# EAGLE design HP4-1 (EAGLE 8.6.3)
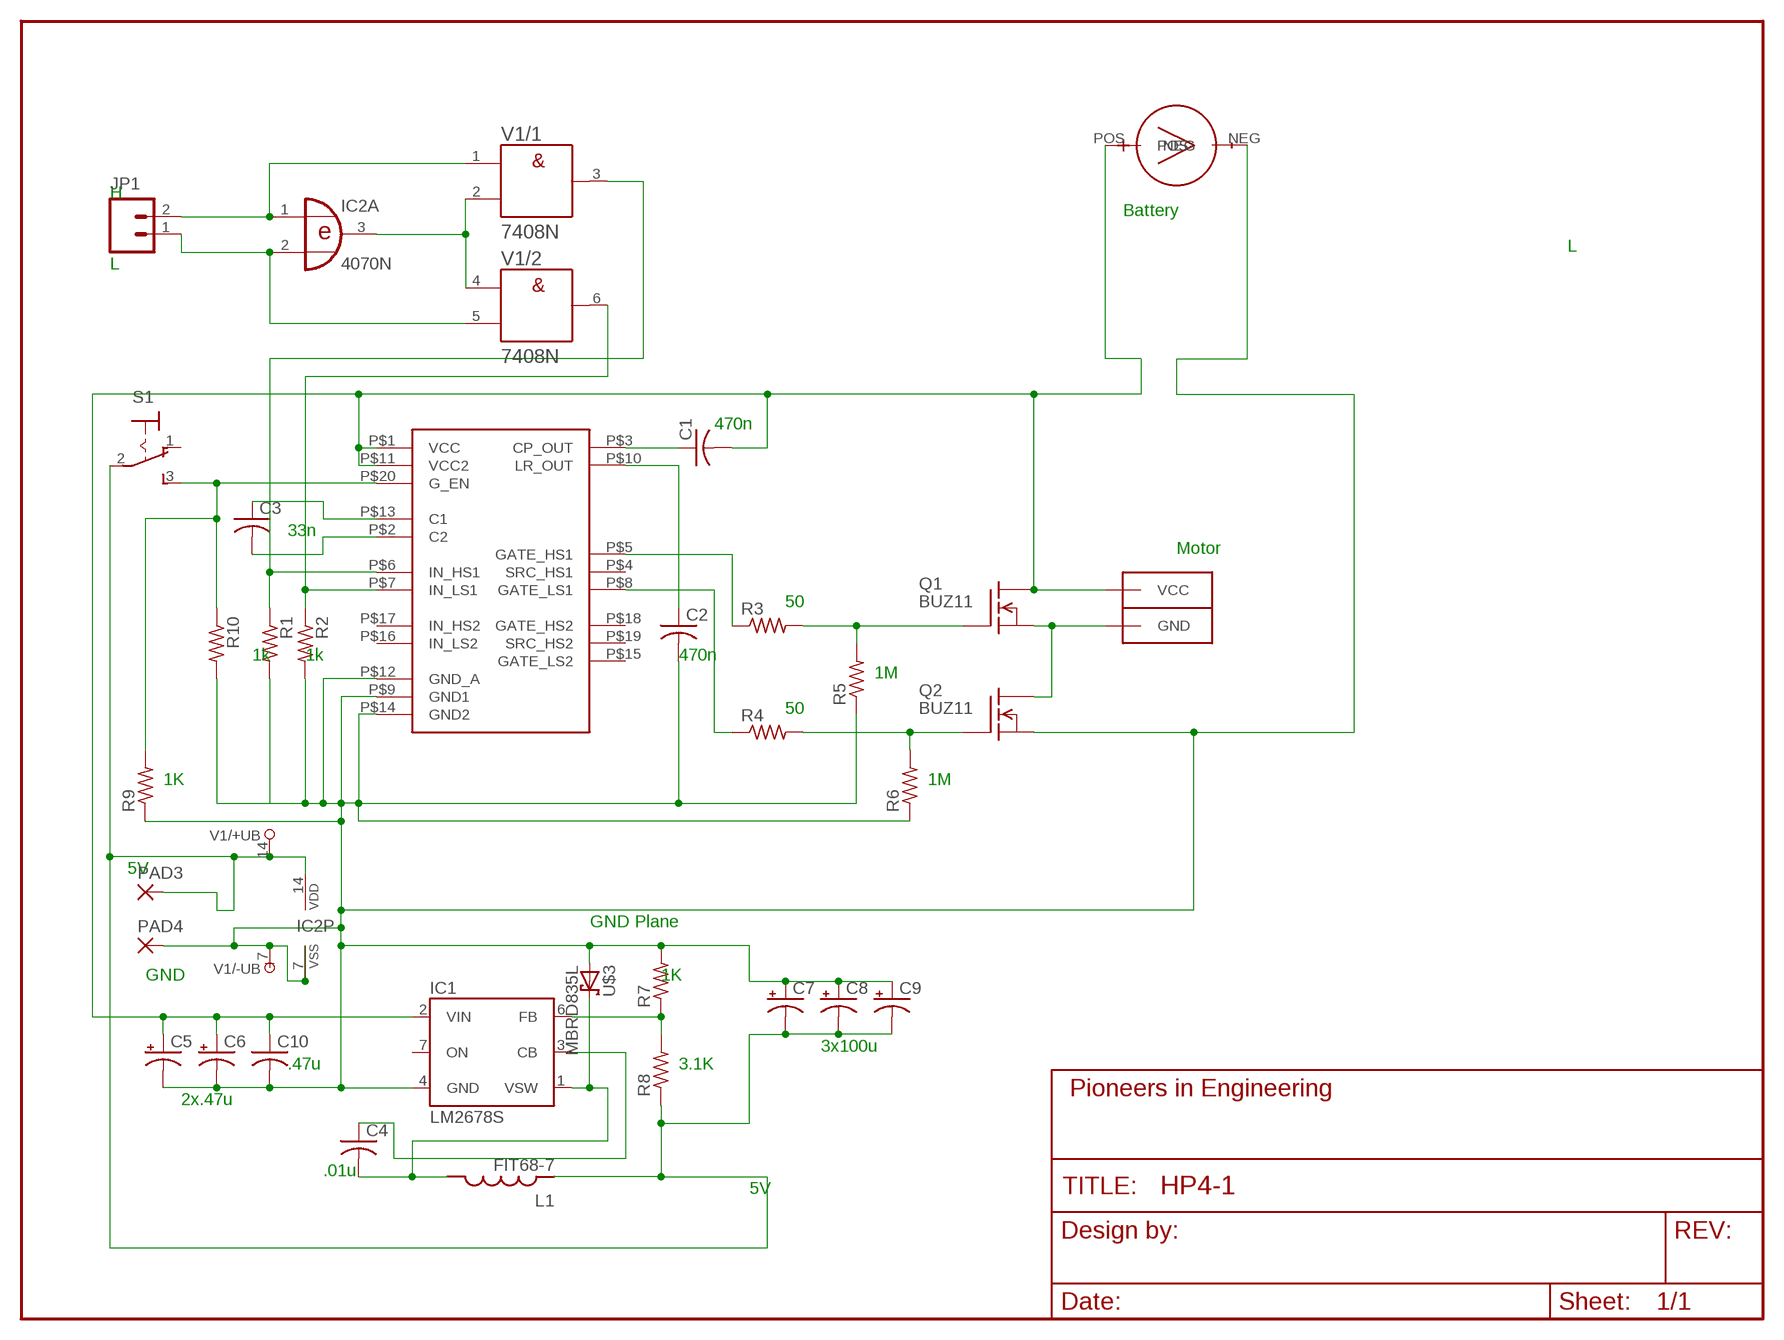
[diagram p0: schematic, sheet 1]

## Parts
C1  C-USC1206  [C1206]
C2  C-USC1206  [C1206]
C3  C-USC1206  [C1206]
C4  C-US025-024X044  [C025-024X044]
C5  CPOL-USCT6032  [CT6032]
C6  CPOL-USCT6032  [CT6032]
C7  CPOL-USCT6032  [CT6032]
C8  CPOL-USCT6032  [CT6032]
C9  CPOL-USCT6032  [CT6032]
C10  C-USC1206  [C1206]
IC1  LM2678S  [TO263-7]
IC2  4070N  [DIL14]
JP1  M02PTH  [1X02]
L1  FIT68-7  [FIT68-7]
MOTOR  ANDERSON_PP_DOUBLEHORIZONTAL  [ANDERSON_PP_DOUB_HORZ]
PAD3  3,17/1,3  [3,17/1,3]
PAD4  3,17/1,3  [3,17/1,3]
Q1  BUZ11  [TO220]
Q2  BUZ11  [TO220]
R1  R-US_M1206  [M1206]
R2  R-US_M1206  [M1206]
R3  R-US_M1206  [M1206]
R4  R-US_M1206  [M1206]
R5  R-US_M1206  [M1206]
R6  R-US_M1206  [M1206]
R7  R-US_R1206  [R1206]
R8  R-US_R1206  [R1206]
R9  R-US_R1206  [R1206]
R10  R-US_M1206  [M1206]
S1  320-916  [320-916]
U$1  MC33883DIL20_600MIL_CARRIER  [DIL20_600MIL]
U$3  MBRD835L  [DPAK]
U$4  BATT  [BATT]
V1  7408N  [DIL14]

## Nets
GND: C2.2 C5.- C6.- C7.+ C8.+ C9.+ C10.2 IC1.4(GND) IC2.7(P:VSS) PAD4.1(P) Q2.3(S) R1.2 R2.2 R5.1 R6.1 R7.2 R9.1 R10.2 U$1.P$9(GND1) U$1.P$12(GND_A) U$1.P$14(GND2) U$3.P$1(A) U$3.P$2(A) U$4.NEG V1.7(/-UB:-UB)
N$1: R1.1 U$1.P$6(IN_HS1) V1.3(/1:Y)
N$2: R2.1 U$1.P$7(IN_LS1) V1.6(/2:Y)
N$4: Q1.1(G) R3.2 R5.2
N$5: C1.1 U$1.P$3(CP_OUT)
N$6: Q2.1(G) R4.2 R6.2
N$7: C1.2 C5.+ C6.+ C10.1 IC1.2(VIN) MOTOR.PIN2(VCC) MOTOR.PIN2-LEAD(VCC) Q1.2(D) U$1.P$1(VCC) U$1.P$11(VCC2) U$4.POS
N$8: MOTOR.PIN1(GND) MOTOR.PIN1-LEAD(GND) Q1.3(S) Q2.2(D)
N$9: IC1.6(FB) R7.1 R8.2
N$10: R3.1 U$1.P$5(GATE_HS1)
N$11: R4.1 U$1.P$8(GATE_LS1)
N$12: C2.1 U$1.P$10(LR_OUT)
N$13: C7.- C8.- C9.- IC2.14(P:VDD) L1.P$1 PAD3.1(P) R8.1 S1.2(P) V1.14(/+UB:+UB)
N$14: C3.1 U$1.P$13(C1)
N$15: C3.2 U$1.P$2(C2)
N$16: IC2.1(A:I0) JP1.2 V1.1(/1:A)
N$17: C4.1 IC1.3(CB)
N$18: C4.2 IC1.1(VSW) L1.P$2 U$3.P$3(C)
N$19: R9.2 R10.1 S1.3(S) U$1.P$20(G_EN)
N$20: IC2.2(A:I1) JP1.1 V1.5(/2:B)
N$21: IC2.3(A:O) V1.2(/1:B) V1.4(/2:A)
Unconnected: IC1.7(ON) IC2.4(B:O) IC2.5(B:I0) IC2.6(B:I1) IC2.8(C:I0) IC2.9(C:I1) IC2.10(C:O) IC2.11(D:O) IC2.12(D:I0) IC2.13(D:I1) S1.1(O) U$1.P$4(SRC_HS1) U$1.P$15(GATE_LS2) U$1.P$16(IN_LS2) U$1.P$17(IN_HS2) U$1.P$18(GATE_HS2) U$1.P$19(SRC_HS2) V1.8(/3:Y) V1.9(/3:A) V1.10(/3:B) V1.11(/4:Y) V1.12(/4:A) V1.13(/4:B)

## Notes on the sheet
- H
- Battery
- L
- L
- 470n
- 33n
- Motor
- 50
- 1k | 1k | 470n
- 1M
- 50
- 1K | 1M
- 5V
- GND Plane
- GND | 1K
- 3x100u
- .47u | 3.1K
- 2x.47u
- .01u
- 5V

## Library data of the parts
C1-C4 C10 = rcl:C-US: CAPACITOR, American symbol
C5-C9 = rcl:CPOL-US: POLARIZED CAPACITOR, American symbol
IC1 = v-reg-3:LM2678: National Semiconductor <http://www.national.com> 5.0A "Simple Switcher"(c) 260kHz, Vout 1.2-37V, Vin 40V, 120mOhm DMOS switch, 50µA standby current
IC2 = 40xx:4070: Quad 2-input XOR
JP1 = ee192_1:M02: 2-pin 0.1-inch header and MTA connector Courtsey of Pioneers in Engineering; PIE-INT-REF-NUM: BULK-STOCK
L1 = ee192_1:FIT68-7: FIT68-7 Switchmode/High Frequency Toroidal Inductor
MOTOR = ee192_1:ANDERSON_PP_DOUBLE: 2-pin 25A Anderson Connector http://www.alliedelec.com/images/products/datasheets/bm/ANDERSON_POWER_PRODUCTS/70162018.pdf; PIE-INT-REF-NUM: Anderson
PAD3 PAD4 = wirepad:3,17/1,3: THROUGH-HOLE PAD
Q1 Q2 = transistor-fet:BUZ11: N-Channel Enhancement MOSFET 50V; 30A; 0,040Ohm
R1-R10 = resistor:R-US_: RESISTOR, American symbol
S1 = switch:320-916: TOGGLE SWITCH distributor RS Components
U$1 = ee192_1:MC33883
U$3 = natcar:MBRD835L
U$4 = natcar:BATT
V1 = 74ttl-din:74*08: Quad 2-input AND gate

## Board
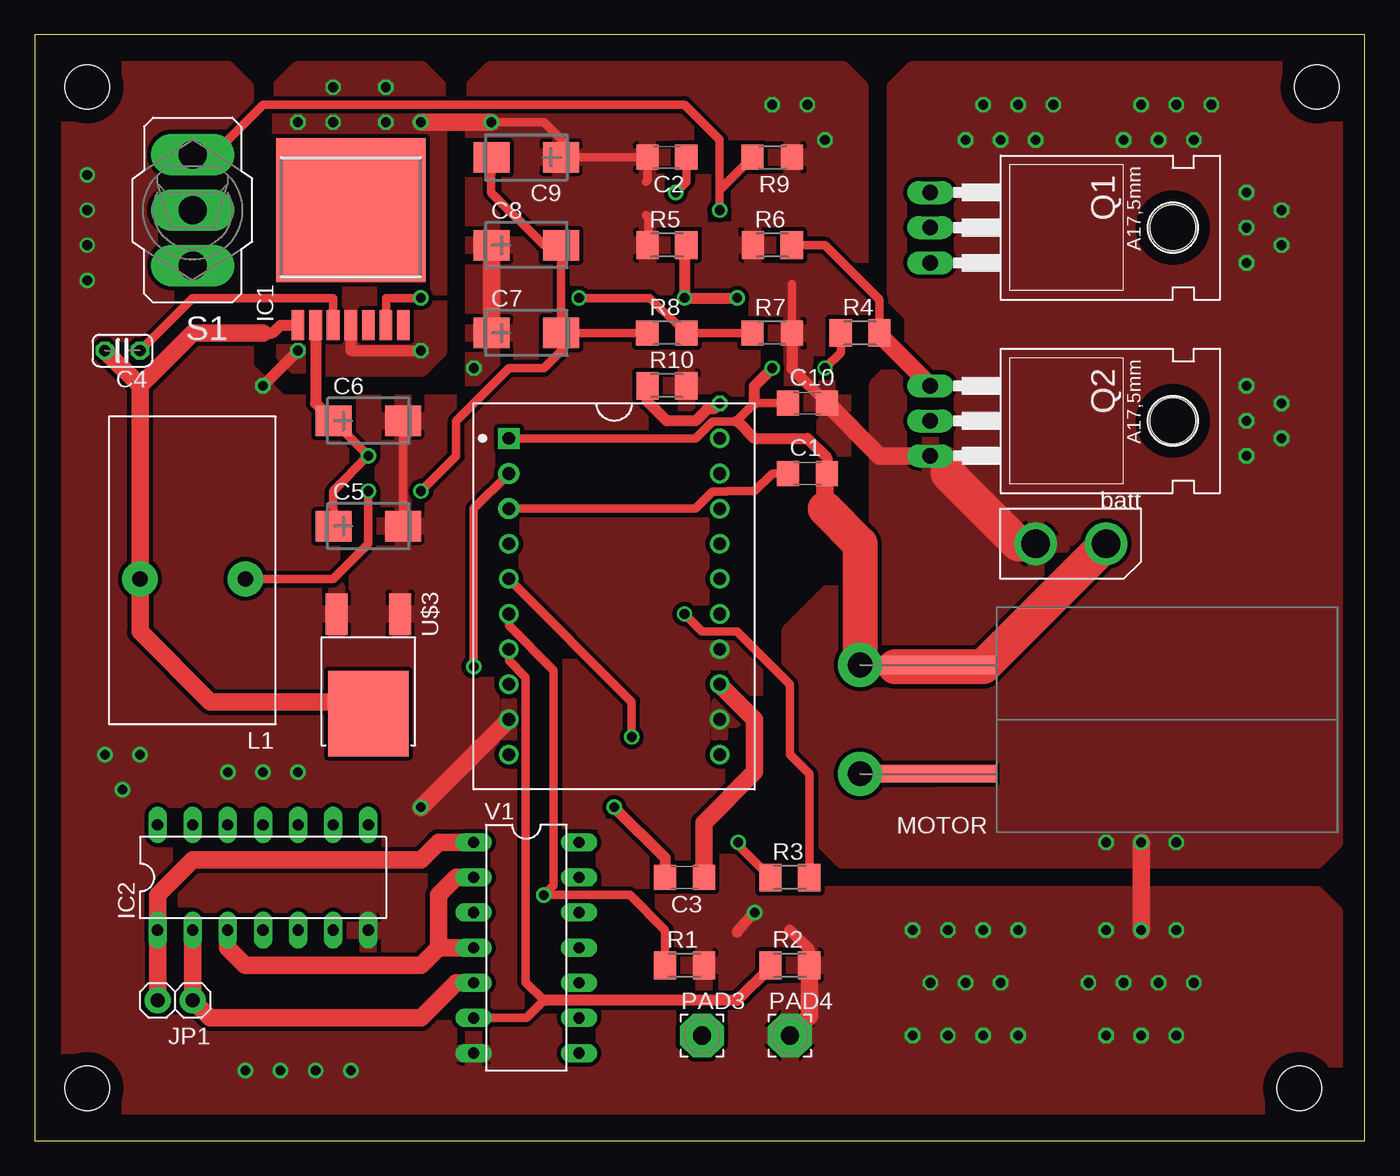
[diagram p1: board, top side]
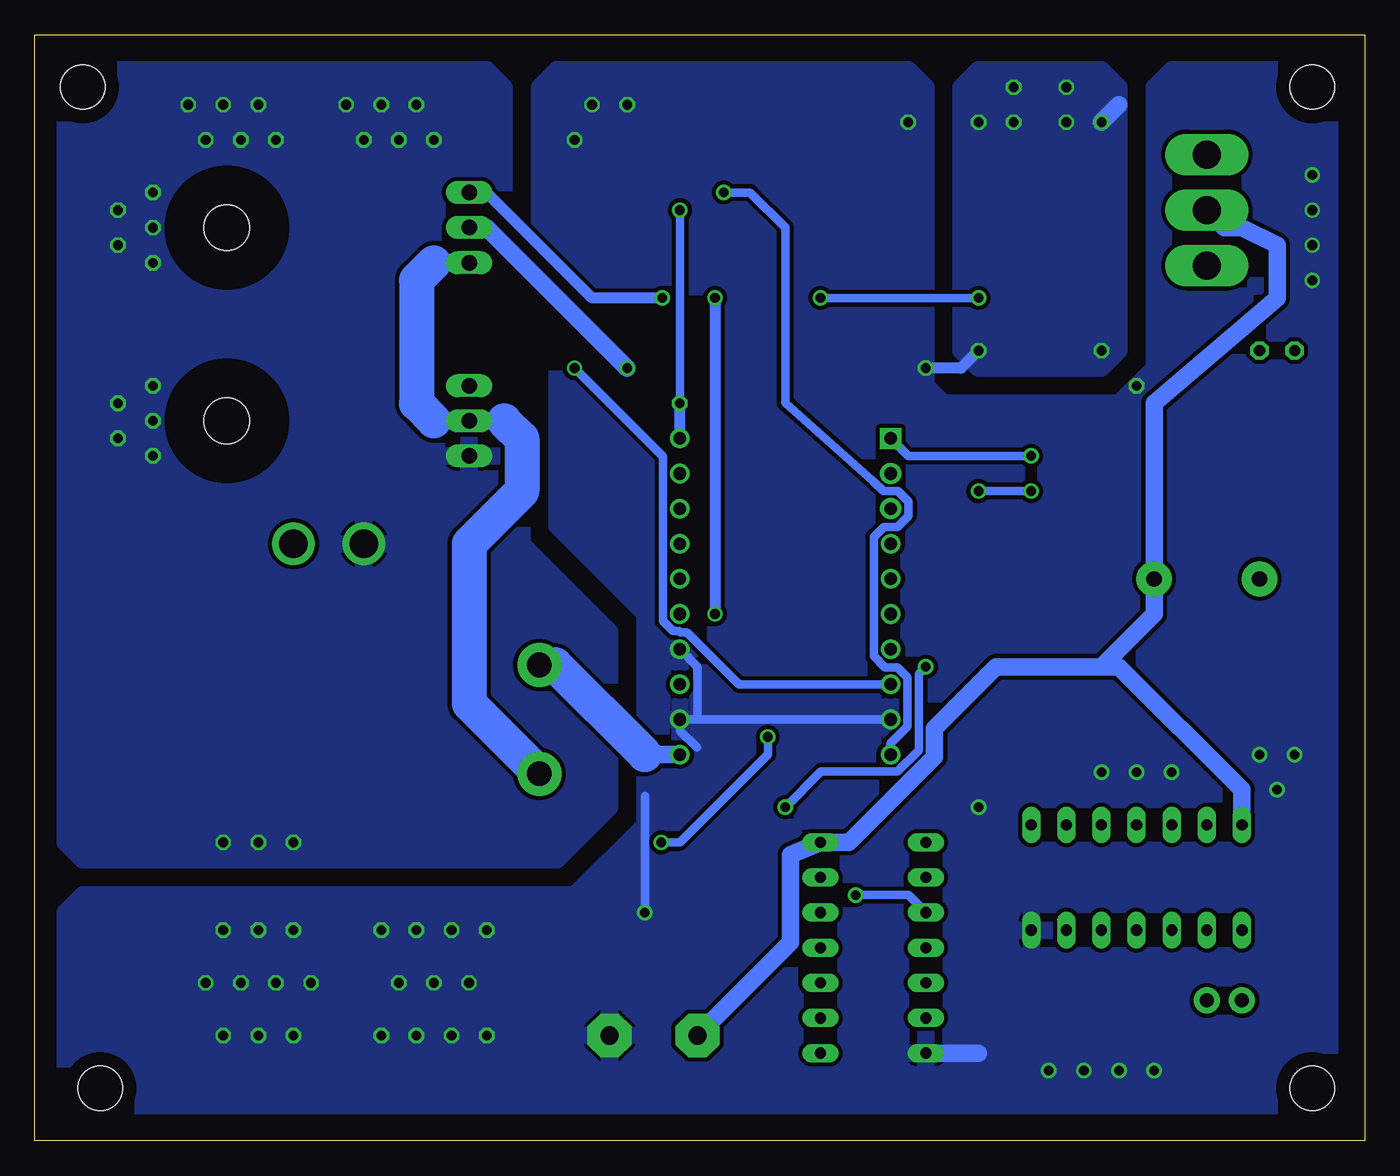
[diagram p2: board, bottom side, seen from below]

Size 96.19 x 80 mm. Coordinates in mm from the lower left corner, seen from the top.
Outline: 0,0 96.19,0 96.19,80 0,80 0,0
Copper layers (1*16): Top 0.035mm / dielectric 1.5mm / Bottom 0.035mm
Design rules "default": minimum track width 10mil, minimum drill 24mil, track to track 8mil, track to pad 8mil, pad to pad 8mil, via to via 8mil, smd to smd 8mil, copper to edge 40mil, drill to drill 8mil, minimum pad ring 10mil, minimum via ring 8mil, stop-mask expansion 4mil, vias tented up to drill 0mil, thermal gap 10mil
Holes 3.2 mm at 3.81,76.2 3.81,3.81 91.44,3.81 92.71,76.2

### Footprints (pad centres in the part's own frame; a part is rotated, then mirrored left to right if it is on the bottom)
C1206 = smd 1.6 x 1.8: 1 -1.4,0; 2 1.4,0
C025-024X044 = drill 0.813 octagon: 1 -1.27,0; 2 1.27,0
CT6032 = smd 2.6 x 2.2: + -2.5,0; - 2.5,0
TO263-7 = smd 0.91 x 2.16: 1 -3.81,-5.78; 2 -2.54,-5.78; 3 -1.27,-5.78; 4 0,-5.78; 5 1.27,-5.78; 6 2.54,-5.78; 7 3.81,-5.78 | smd 10.8 x 10.41: 8 0,2.54
DIL14 = drill 0.813 long: 1 -7.62,-3.81; 2 -5.08,-3.81; 3 -2.54,-3.81; 4 0,-3.81; 5 2.54,-3.81; 6 5.08,-3.81; 7 7.62,-3.81; 8 7.62,3.81; 9 5.08,3.81; 10 2.54,3.81; 11 0,3.81; 12 -2.54,3.81; 13 -5.08,3.81; 14 -7.62,3.81
1X02 = drill 1.016 pad 1.88: 1 -1.27,0; 2 1.27,0
FIT68-7 = drill 1.1 pad 2.54: P$1 -3.81,0; P$2 3.81,0
ANDERSON_PP_DOUB_HORZ = drill 1.778 pad 3.175: PIN1 0,3.937; PIN2 0,-3.937 | smd 8.89 x 1.27: PIN1-LEAD -5.334,3.937; PIN2-LEAD -5.334,-3.937
3,17/1,3 = drill 1.321 pad 3.175 octagon: 1 0,0
TO220 = drill 1.118 long: 1 -2.54,-6.35; 2 0,-6.35; 3 2.54,-6.35 | hole 3.302: 0,11.176
M1206 = smd 1.6 x 2: 1 -1.4,0; 2 1.4,0
R1206 = smd 1.6 x 1.803: 1 -1.422,0; 2 1.422,0
320-916 = drill 2.007 long: 1 0,4.013; 2 0,0; 3 0,-4.013
DIL20_600MIL = drill 0.914 pad 1.524 square: P$1 -11.43,-7.62 | drill 0.914 pad 1.524: P$2 -8.89,-7.62; P$3 -6.35,-7.62 | drill 0.914: P$4 -3.81,-7.62; P$5 -1.27,-7.62; P$6 1.27,-7.62; P$7 3.81,-7.62; P$8 6.35,-7.62; P$9 8.89,-7.62; P$10 11.43,-7.62; P$11 11.43,7.62; P$12 8.89,7.62; P$13 6.35,7.62; P$14 3.81,7.62; P$15 1.27,7.62; P$16 -1.27,7.62; P$17 -3.81,7.62; P$18 -6.35,7.62; P$19 -8.89,7.62; P$20 -11.43,7.62
DPAK = smd 1.6 x 3: P$1 -2.3,0; P$2 2.3,0 | smd 5.8 x 6.2: P$3 0,7.2
BATT = drill 2.052: NEG -2.54,0; POS -7.62,0

### Placement (x,y rotation side)
C1  55.88,48.26 0 top
C2  45.72,71.12 180 top
C3  46.99,19.05 180 top
C4  6.35,57.15 180 top
C5  24.13,44.45 0 top
C6  24.13,52.07 0 top
C7  35.56,58.42 0 top
C8  35.56,64.77 0 top
C9  35.56,71.12 180 top
C10  55.88,53.34 0 top
IC1  22.86,64.77 0 top
IC2  16.51,19.05 0 top
JP1  10.16,10.16 180 top
L1  11.43,40.64 180 top
MOTOR  59.69,30.48 180 top
PAD3  48.26,7.62 0 top
PAD4  54.61,7.62 0 top
Q1  71.12,66.04 270 top
Q2  71.12,52.07 270 top
R1  46.99,12.7 0 top
R2  54.61,12.7 0 top
R3  54.61,19.05 0 top
R4  59.69,58.42 0 top
R5  45.72,64.77 0 top
R6  53.34,64.77 0 top
R7  53.34,58.42 0 top
R8  45.72,58.42 0 top
R9  53.34,71.12 180 top
R10  45.72,54.61 0 top
S1  11.43,67.31 180 top
U$1  41.91,39.37 270 top
U$3  24.13,38.1 180 top
U$4  69.85,43.18 180 top
V1  35.56,13.97 270 top

### Tracks (layer width: path | path; a pad name or v marks a point on that pad's centre or on a via)
GND  (via drill 0.7)
  Top 0.254: 26.54,44.37 C5.- | 26.54,38.2 U$3.P$1 26.31,38.2 | 21.97,38.2 U$3.P$2 | 26.54,52.15 C6.- 26.77,52.15 | 32.94,58.32 C7.+ | 38.1,71.12 C9.+ 37.97,71.12 | 44.37,64.95 R5.1 44.14,64.72 | 44.37,71.12 C2.2 | 33.17,64.72 C8.+
  Top 0.61: U$1.P$9 34.05,30.48 | 54.76,61.95 R7.2 | R5.1 44.6,64.77 | 31.75,73.66 v33.02,73.66 36.83,73.66 38.1,72.39 38.1,71.12 | C9.+ 44.37,71.12 | C2.2 44.32,69.47 44.2,69.35 | 44.2,66.94 44.37,66.77 44.37,64.95 | C5.- C6.-
  Top 0.813: v52.07,16.51 50.8,15.11 50.93,15.24 | R2.2 56.01,13.84 54.61,15.24 | 26.54,52.2 26.54,52.15 | R7.2 54.76,55.86 C10.2 | v19.05,57.15 v16.51,54.61 | IC1.4 22.86,57.15 v27.94,57.15
  Top 1.27: v27.94,24.13 U$1.P$9 | PAD4.1 56.01,9.02 R2.2 | 66.04,48.26 Q2.3 61.09,49.53 C10.2 | C8.+ C7.+ | v80.01,21.59 v80.01,15.24 | v27.94,73.66 v33.02,73.66
  Top 2.54: 66.04,48.26 71.12,43.18 U$4.NEG
  Bottom 0.61: U$1.P$9 48.26,30.48 | 48.26,30.48 U$1.P$12 49.53,29.66 48.31,28.45 | U$1.P$14 48.26,34.29 48.26,30.48 | v52.07,16.51 52.07,24.95
  Bottom 0.813: v27.94,57.15 29.21,55.88 v31.75,55.88
  Bottom 1.27: 27.94,6.35 V1.7 | v19.05,73.66 17.78,74.93
  other vias: 78.74,11.43 81.28,11.43 76.2,11.43 77.47,15.24 82.55,15.24 83.82,11.43 77.47,7.62 80.01,7.62 82.55,7.62 71.12,7.62 68.58,7.62 66.04,7.62 63.5,7.62 64.77,11.43 67.31,11.43 69.85,11.43 71.12,15.24 68.58,15.24 66.04,15.24 63.5,15.24 15.24,5.08 17.78,5.08 20.32,5.08 22.86,5.08 6.35,25.4 5.08,27.94 7.62,27.94 13.97,26.67 16.51,26.67 19.05,26.67 3.81,62.23 3.81,64.77 3.81,67.31 3.81,69.85 53.34,74.93 55.88,74.93 57.15,72.39 67.31,72.39 68.58,74.93 69.85,72.39 71.12,74.93 73.66,74.93 72.39,72.39 80.01,74.93 78.74,72.39 81.28,72.39 82.55,74.93 85.09,74.93 83.82,72.39 87.63,68.58 87.63,66.04 87.63,63.5 90.17,64.77 90.17,67.31 87.63,54.61 87.63,52.07 87.63,49.53 90.17,50.8 90.17,53.34 77.47,21.59 82.55,21.59 21.59,73.66 25.4,73.66 25.4,76.2 21.59,76.2
  pour Bottom (isolate 0.305): 2.54,76.2 3.81,77.47 13.97,77.47 15.24,76.2 15.24,55.88 17.78,53.34 30.48,53.34 31.75,54.61 31.75,76.2 33.02,77.47 58.42,77.47 59.69,76.2 59.69,60.96 60.96,59.69 58.42,55.88 58.42,44.45 52.07,38.1 52.07,22.86 57.15,17.78 92.71,17.78 93.98,16.51 93.98,3.81 92.71,2.54 3.81,2.54 2.54,3.81
  pour Top (isolate 0.305): 2.54,76.2 3.81,77.47 13.97,77.47 15.24,76.2 15.24,55.88 17.78,53.34 30.48,53.34 31.75,54.61 31.75,76.2 33.02,77.47 58.42,77.47 59.69,76.2 59.69,60.96 60.96,59.69 58.42,55.88 58.42,44.45 52.07,38.1 52.07,22.86 57.15,17.78 92.71,17.78 93.98,16.51 93.98,3.81 92.71,2.54 3.81,2.54 2.54,3.81
  pour Top (isolate 0.305): 17.78,76.2 17.78,57.15 19.05,55.88 27.94,55.88 29.21,57.15 29.21,76.2 27.94,77.47 19.05,77.47
  pour Bottom (isolate 0.305): 93.98,76.2 92.71,77.47 63.5,77.47 62.23,76.2 62.23,60.96 63.5,59.69 63.5,57.15 60.96,54.61 60.96,43.18 54.61,36.83 54.61,24.13 58.42,20.32 92.71,20.32 93.98,21.59
  pour Top (isolate 0.305): 58.42,20.32 92.71,20.32 93.98,21.59 93.98,76.2 92.71,77.47 63.5,77.47 62.23,76.2 62.23,60.96 63.5,59.69 63.5,57.15 60.96,54.61 60.96,43.18 54.61,36.83 54.61,24.13
  pour Bottom (isolate 0.305): 19.05,77.47 17.78,76.2 17.78,57.15 19.05,55.88 27.94,55.88 29.21,57.15 29.21,76.2 27.94,77.47
N$1  (via drill 0.7)
  Top 0.61: U$1.P$6 34.29,37.28 37.54,34.03 37.54,18.49 v36.83,17.78 43.05,17.78 45.59,15.24 R1.1
  Bottom 0.61: v36.83,17.78 33.02,17.78 V1.3
N$2
  Top 0.61: V1.6 35.56,8.89 36.83,10.16 35.51,11.48 35.51,33.52 34.29,34.74 U$1.P$7
  Top 0.813: R2.1 53.21,12.57 50.8,10.16 36.83,10.16
N$4  (via drill 0.7)
  Top 0.61: v46.99,38.1 48.26,36.83 50.8,36.83 54.61,33.02 54.61,27.94 56.01,26.54 R3.2
  Top 0.813: R5.2 46.99,64.64 v46.99,60.96 v50.8,60.96
  Bottom 0.813: v46.99,60.96 v46.99,38.1 | v50.8,60.96 55.88,60.96 63.5,68.58 Q1.1
N$5
  Top 0.61: U$1.P$3 47.81,45.72 49.02,46.94 50.03,46.94 50.09,46.99 52.07,46.99 53.34,48.26 C1.1
N$6
  Top 0.61: R4.2 61.09,60.83 57.15,64.77 R6.2
  Top 1.27: R4.2 61.09,58.29 Q2.1
N$7  (via drill 0.7)
  Top 0.254: 21.51,52.15 C6.+ 21.51,51.92 | 21.51,44.37 C5.+
  Top 0.61: C6.+ 24.13,49.57 | 24.13,49.57 v24.13,49.53 | U$1.P$1 47.81,50.8 49.02,52.02 50.72,52.02 52.04,53.34 C10.1 | C5.+ 21.59,46.99 24.13,49.57
  Top 0.813: IC1.2 20.32,53.34 21.59,52.07 C6.+ | 52.04,53.34 52.04,54.58 v53.34,55.88 | 50.72,52.02 50.85,52.02 52.07,50.8 55.88,50.8 57.28,49.4 C1.2
  Top 1.27: C1.2 57.15,48.13 57.15,45.72 | 62.23,34.29 59.82,34.29 MOTOR.PIN2 MOTOR.PIN2-LEAD
  Top 2.54: 57.15,45.72 59.69,43.18 MOTOR.PIN2 | U$4.POS 68.58,34.29 62.23,34.29
  Bottom 0.61: v24.13,49.53 33.02,49.53 U$1.P$1
  Bottom 1.27: v53.34,55.88 63.5,66.04 Q1.2 | U$1.P$11 52.07,27.94
  Bottom 2.54: 52.07,27.94 58.55,34.42 MOTOR.PIN2
N$8
  Top 1.27: MOTOR.PIN1 MOTOR.PIN1-LEAD
  Bottom 1.27: Q1.3 67.31,63.5 | 67.31,52.07 Q2.2 62.23,52.07
  Bottom 2.54: 67.31,63.5 68.58,62.23 68.58,53.34 67.31,52.07 | 62.23,52.07 60.96,50.8 60.96,46.99 64.77,43.18 64.77,31.62 MOTOR.PIN1
N$9  (via drill 0.7)
  Top 0.254: 47.12,58.55 R8.2
  Top 0.61: R7.1 R8.2 44.45,60.96 v39.37,60.96 | v27.94,60.96 25.4,60.96 IC1.6
  Bottom 0.61: v39.37,60.96 v27.94,60.96
N$10  (via drill 0.7)
  Top 0.61: R3.1 50.67,21.59 v50.88,21.59 | v43.18,29.21 43.18,31.75 U$1.P$5
  Bottom 0.61: v50.88,21.59 49.53,21.59 43.18,27.94 v43.18,29.21
N$11  (via drill 0.7)
  Top 0.61: R4.1 58.29,57.02 v57.15,55.88
  Bottom 0.61: v57.15,55.88 54.61,53.34 50.75,49.48 50.75,37.59 50.03,36.88 49.58,36.88 49.48,36.78 49.02,36.78 45.27,33.02 U$1.P$8
N$12  (via drill 0.7)
  Top 0.61: 46.99,70.99 C2.1 47.12,69.35 v46.35,68.58
  Bottom 0.61: U$1.P$10 34.29,28.76 33.07,29.97 33.07,33.52 33.79,34.24 34.69,34.24 35.51,35.05 35.51,43.69 34.8,44.4 33.81,44.4 33.02,45.19 33.02,46.25 33.76,46.99 34.82,46.99 35.56,47.73 41.91,53.34 41.91,66.04 44.45,68.58 v46.35,68.58
N$13  (via drill 0.7, 0.7 pad 0.61)
  Top 0.254: 32.94,71.12 C9.- | 44.14,58.55 R8.1 | 38.2,58.55 C7.-
  Top 0.61: C7.- R8.1 | C7.- C8.- 36.83,64.77 33.02,68.58 C9.- | L1.P$1 21.59,40.64 24.13,43.18 v24.13,46.99 | v27.94,46.99 30.48,49.53 30.48,52.07 34.29,55.88 36.83,55.88 38.1,57.15 C7.-
  Bottom 0.61: v24.13,46.99 v27.94,46.99
  Bottom 1.27: 19.05,34.29 15.24,38.1 L1.P$1 15.24,53.34 6.35,60.96 6.35,64.77 8.89,66.04 10.16,66.04 S1.2 | 19.05,34.29 26.67,34.29 31.11,29.84 31.11,27.77 37.3,21.59 V1.14 41.53,20.7 41.53,14.35 PAD3.1 | IC2.14 8.89,25.4 17.78,34.29 19.05,34.29
N$14
  Top 1.27: U$1.P$13 52.07,30.48 52.07,26.67 48.39,22.99 C3.1
N$15  (via drill 0.7)
  Top 0.61: U$1.P$2 31.75,45.72 v31.75,34.29
  Top 0.813: v41.91,24.13 45.59,20.45 C3.2
  Bottom 0.61: v31.75,34.29 32.26,33.78 32.26,28.25 33.79,26.72 39.32,26.72 v41.91,24.13
N$16
  Top 0.254: 8.94,15.34 IC2.1
  Top 1.27: JP1.2 IC2.1 8.89,17.78 11.43,20.32 27.94,20.32 29.21,21.59 V1.1
N$17
  Top 0.61: C4.1 11.43,60.96 21.59,60.96 IC1.3
N$18
  Top 0.254: 24.03,31.11 U$3.P$3 | 7.8,40.49 L1.P$2
  Top 0.813: 16.51,58.42 17.21,58.42 17.78,58.99 IC1.1
  Top 1.27: U$3.P$3 22.86,31.75 12.7,31.75 7.62,36.83 L1.P$2 7.62,54.61 | 7.62,54.61 11.43,58.42 16.51,58.42 | 7.62,54.61 C4.2
N$19  (via drill 0.7)
  Top 0.61: 49.53,68.73 R9.2 | 49.53,68.73 v49.53,67.31 | 49.53,68.73 49.53,72.39 46.99,74.93 16.51,74.93 12.9,71.32 S1.3
  Top 0.813: v49.53,53.34 49.12,52.93 48.65,52.93 47.78,52.07 45.72,52.07 44.32,53.47 R10.1
  Bottom 0.61: v49.53,67.31 v49.53,53.34
  Bottom 0.813: U$1.P$20 v49.53,53.34
N$20
  Top 1.27: IC2.2 JP1.1 12.7,8.89 27.94,8.89 30.48,11.43 V1.5
N$21
  Top 1.27: IC2.3 13.97,13.97 15.24,12.7 27.94,12.7 29.21,13.97 | 29.21,13.97 V1.4 | 29.21,13.97 29.21,17.78 30.48,19.05 V1.2